# EAGLE schematic brains (EAGLE 5.11)

## Sheet 1 of 6
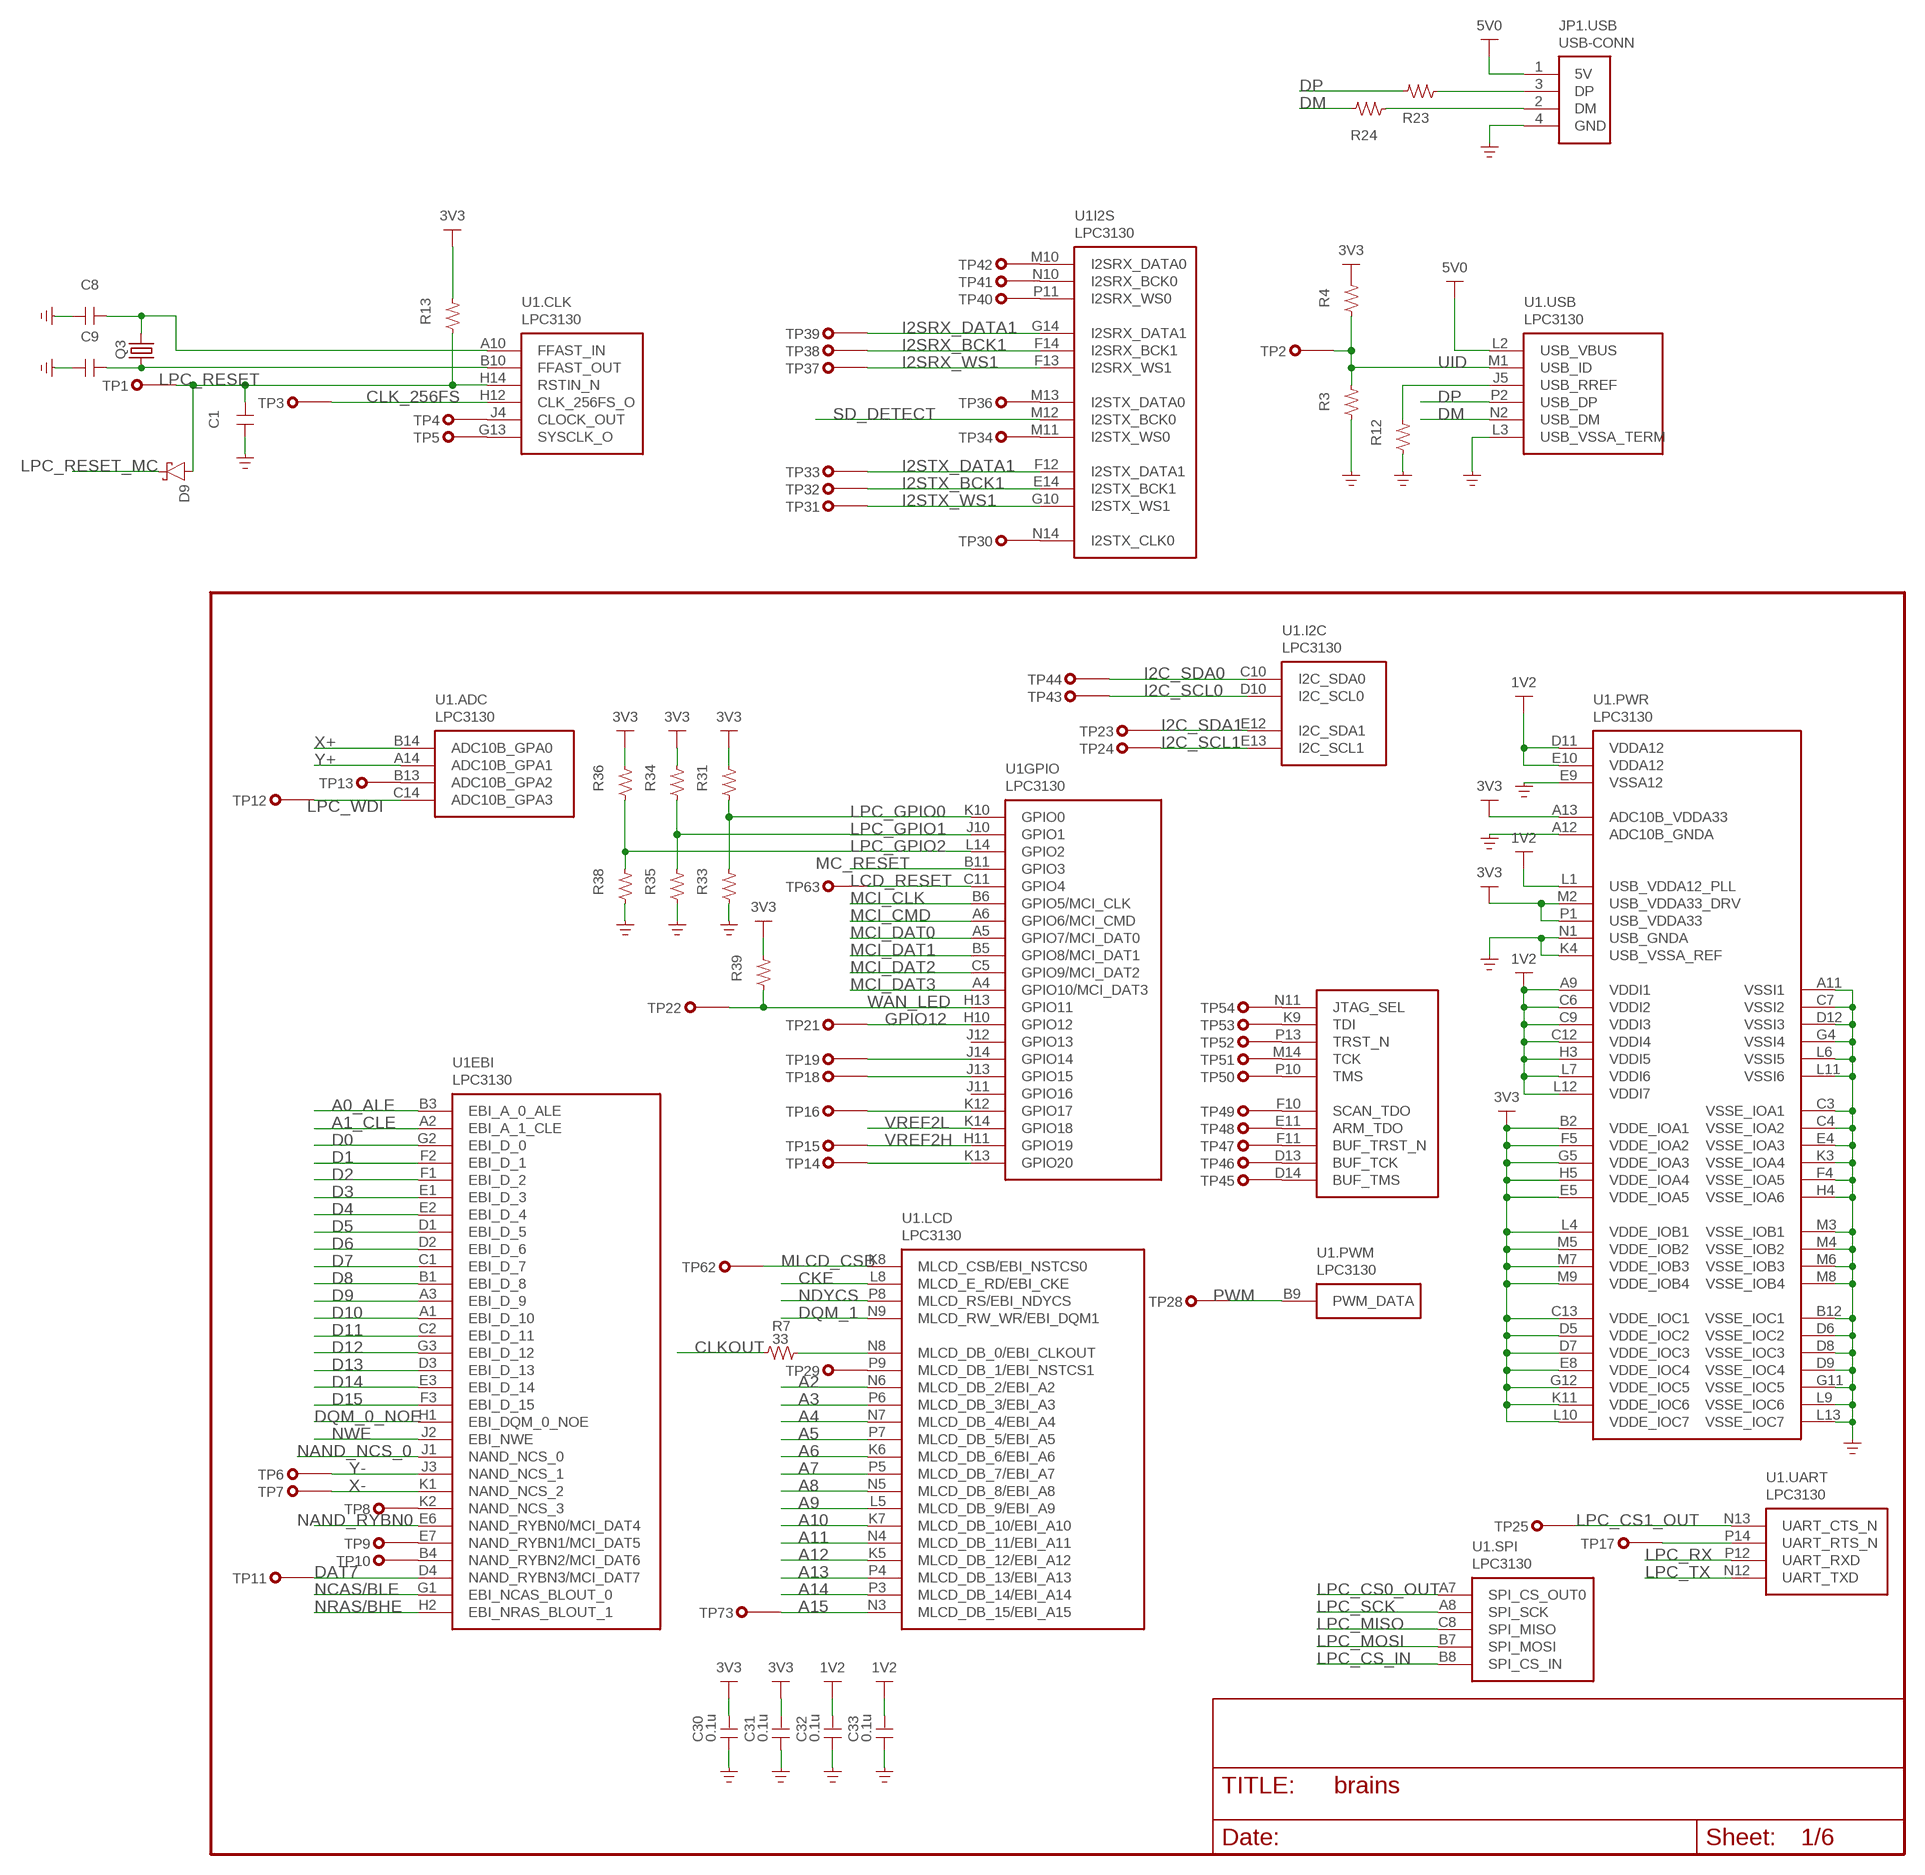
[diagram p0: schematic, sheet 1]

### Parts
C1  C-0805  [SMD0805]
C8  C-0603  [SMD0603]
C9  C-0603  [SMD0603]
C30  0.1u  C-0603  [SMD0603]
C31  0.1u  C-0603  [SMD0603]
C32  0.1u  C-0603  [SMD0603]
C33  0.1u  C-0603  [SMD0603]
D9  D-SCHOTTKY-0603  [0603-SCHOTTKY]
JP1  USB-CONN  [UE27AC]
Q3  CRYSTAL  [SM49]
R3  R-0603  [SMD0603]
R4  R-0603  [SMD0603]
R7  33  R-0603  [SMD0603]
R12  R-0603  [SMD0603]
R13  R-0603  [SMD0603]
R23  R-0603  [SMD0603]
R24  R-0603  [SMD0603]
R31  R-0603  [SMD0603]
R33  R-0603  [SMD0603]
R34  R-0603  [SMD0603]
R35  R-0603  [SMD0603]
R36  R-0603  [SMD0603]
R38  R-0603  [SMD0603]
R39  R-0603  [SMD0603]
TP1  TP-10MIL  [10MIL]
TP2  TP-10MIL  [10MIL]
TP3  TP-10MIL  [10MIL]
TP4  TP-10MIL  [10MIL]
TP5  TP-10MIL  [10MIL]
TP6  TP-10MIL  [10MIL]
TP7  TP-10MIL  [10MIL]
TP8  TP-10MIL  [10MIL]
TP9  TP-10MIL  [10MIL]
TP10  TP-10MIL  [10MIL]
TP11  TP-10MIL  [10MIL]
TP12  TP-10MIL  [10MIL]
TP13  TP-10MIL  [10MIL]
TP14  TP-10MIL  [10MIL]
TP15  TP-10MIL  [10MIL]
TP16  TP-10MIL  [10MIL]
TP17  TP-10MIL  [10MIL]
TP18  TP-10MIL  [10MIL]
TP19  TP-10MIL  [10MIL]
TP21  TP-10MIL  [10MIL]
TP22  TP-10MIL  [10MIL]
TP23  TP-10MIL  [10MIL]
TP24  TP-10MIL  [10MIL]
TP25  TP-10MIL  [10MIL]
TP28  TP-10MIL  [10MIL]
TP29  TP-10MIL  [10MIL]
TP30  TP-10MIL  [10MIL]
TP31  TP-10MIL  [10MIL]
TP32  TP-10MIL  [10MIL]
TP33  TP-10MIL  [10MIL]
TP34  TP-10MIL  [10MIL]
TP36  TP-10MIL  [10MIL]
TP37  TP-10MIL  [10MIL]
TP38  TP-10MIL  [10MIL]
TP39  TP-10MIL  [10MIL]
TP40  TP-10MIL  [10MIL]
TP41  TP-10MIL  [10MIL]
TP42  TP-10MIL  [10MIL]
TP43  TP-10MIL  [10MIL]
TP44  TP-10MIL  [10MIL]
TP45  TP-10MIL  [10MIL]
TP46  TP-10MIL  [10MIL]
TP47  TP-10MIL  [10MIL]
TP48  TP-10MIL  [10MIL]
TP49  TP-10MIL  [10MIL]
TP50  TP-10MIL  [10MIL]
TP51  TP-10MIL  [10MIL]
TP52  TP-10MIL  [10MIL]
TP53  TP-10MIL  [10MIL]
TP54  TP-10MIL  [10MIL]
TP62  TP-10MIL  [10MIL]
TP63  TP-10MIL  [10MIL]
TP73  TP-10MIL  [10MIL]
U1  LPC3130  [SOT570-3]

### Nets
1V2: C32.2 C33.2 U1.A9(.PWR:VDDI1) U1.C6(.PWR:VDDI2) U1.C9(.PWR:VDDI3) U1.C12(.PWR:VDDI4) U1.D11(.PWR:VDDA12) U1.E10(.PWR:VDDA12) U1.H3(.PWR:VDDI5) U1.L1(.PWR:USB_VDDA12_PLL) U1.L7(.PWR:VDDI6) U1.L12(.PWR:VDDI7) ; also sheet 5
3V3 [power]: C30.2 C31.2 R4.2 R13.2 R31.2 R34.2 R36.2 R39.2 U1.A13(.PWR:ADC10B_VDDA33) U1.B2(.PWR:VDDE_IOA1) U1.C13(.PWR:VDDE_IOC1) U1.D5(.PWR:VDDE_IOC2) U1.D7(.PWR:VDDE_IOC3) U1.E5(.PWR:VDDE_IOA5) U1.E8(.PWR:VDDE_IOC4) U1.F5(.PWR:VDDE_IOA2) U1.G5(.PWR:VDDE_IOA3) U1.G12(.PWR:VDDE_IOC5) U1.H5(.PWR:VDDE_IOA4) U1.K11(.PWR:VDDE_IOC6) U1.L4(.PWR:VDDE_IOB1) U1.L10(.PWR:VDDE_IOC7) U1.M2(.PWR:USB_VDDA33_DRV) U1.M5(.PWR:VDDE_IOB2) U1.M7(.PWR:VDDE_IOB3) U1.M9(.PWR:VDDE_IOB4) U1.P1(.PWR:USB_VDDA33) ; also sheet 2,3,4,5,6
5V0: JP1.1(.USB:5V) U1.L2(.USB:USB_VBUS) ; also sheet 3,5
A0_ALE: U1.B3(EBI:EBI_A_0_ALE) ; also sheet 2
A1_CLE: U1.A2(EBI:EBI_A_1_CLE) ; also sheet 2
A2: U1.N6(.LCD:MLCD_DB_2/EBI_A2) ; also sheet 2
A3: U1.P6(.LCD:MLCD_DB_3/EBI_A3) ; also sheet 2
A4: U1.N7(.LCD:MLCD_DB_4/EBI_A4) ; also sheet 2
A5: U1.P7(.LCD:MLCD_DB_5/EBI_A5) ; also sheet 2
A6: U1.K6(.LCD:MLCD_DB_6/EBI_A6) ; also sheet 2
A7: U1.P5(.LCD:MLCD_DB_7/EBI_A7) ; also sheet 2
A8: U1.N5(.LCD:MLCD_DB_8/EBI_A8) ; also sheet 2
A9: U1.L5(.LCD:MLCD_DB_9/EBI_A9) ; also sheet 2
A10: U1.K7(.LCD:MLCD_DB_10/EBI_A10) ; also sheet 2
A11: U1.N4(.LCD:MLCD_DB_11/EBI_A11) ; also sheet 2
A12: U1.K5(.LCD:MLCD_DB_12/EBI_A12) ; also sheet 2
A13: U1.P4(.LCD:MLCD_DB_13/EBI_A13) ; also sheet 2
A14: U1.P3(.LCD:MLCD_DB_14/EBI_A14) ; also sheet 2
A15: TP73.1 U1.N3(.LCD:MLCD_DB_15/EBI_A15)
CKE: U1.L8(.LCD:MLCD_E_RD/EBI_CKE) ; also sheet 2
CLK_256FS: TP3.1 U1.H12(.CLK:CLK_256FS_O)
CLKOUT: R7.1 ; also sheet 2
D0: U1.G2(EBI:EBI_D_0) ; also sheet 2
D1: U1.F2(EBI:EBI_D_1) ; also sheet 2
D2: U1.F1(EBI:EBI_D_2) ; also sheet 2
D3: U1.E1(EBI:EBI_D_3) ; also sheet 2
D4: U1.E2(EBI:EBI_D_4) ; also sheet 2
D5: U1.D1(EBI:EBI_D_5) ; also sheet 2
D6: U1.D2(EBI:EBI_D_6) ; also sheet 2
D7: U1.C1(EBI:EBI_D_7) ; also sheet 2
D8: U1.B1(EBI:EBI_D_8) ; also sheet 2
D9: U1.A3(EBI:EBI_D_9) ; also sheet 2
D10: U1.A1(EBI:EBI_D_10) ; also sheet 2
D11: U1.C2(EBI:EBI_D_11) ; also sheet 2
D12: U1.G3(EBI:EBI_D_12) ; also sheet 2
D13: U1.D3(EBI:EBI_D_13) ; also sheet 2
D14: U1.E3(EBI:EBI_D_14) ; also sheet 2
D15: U1.F3(EBI:EBI_D_15) ; also sheet 2
DAT7: TP11.1 U1.D4(EBI:NAND_RYBN3/MCI_DAT7)
DM: R24.2 U1.N2(.USB:USB_DM)
DP: R23.2 U1.P2(.USB:USB_DP)
DQM_0_NOE: U1.H1(EBI:EBI_DQM_0_NOE) ; also sheet 2
DQM_1: U1.N9(.LCD:MLCD_RW_WR/EBI_DQM1) ; also sheet 2
GND [power]: C1.1 C8.1 C9.1 C30.1 C31.1 C32.1 C33.1 JP1.4(.USB:GND) R3.1 R12.1 R33.1 R35.1 R38.1 U1.A11(.PWR:VSSI1) U1.A12(.PWR:ADC10B_GNDA) U1.B12(.PWR:VSSE_IOC1) U1.C3(.PWR:VSSE_IOA1) U1.C4(.PWR:VSSE_IOA2) U1.C7(.PWR:VSSI2) U1.D6(.PWR:VSSE_IOC2) U1.D8(.PWR:VSSE_IOC3) U1.D9(.PWR:VSSE_IOC4) U1.D12(.PWR:VSSI3) U1.E4(.PWR:VSSE_IOA3) U1.E9(.PWR:VSSA12) U1.F4(.PWR:VSSE_IOA5) U1.G4(.PWR:VSSI4) U1.G11(.PWR:VSSE_IOC5) U1.H4(.PWR:VSSE_IOA6) U1.K3(.PWR:VSSE_IOA4) U1.K4(.PWR:USB_VSSA_REF) U1.L3(.USB:USB_VSSA_TERM) U1.L6(.PWR:VSSI5) U1.L9(.PWR:VSSE_IOC6) U1.L11(.PWR:VSSI6) U1.L13(.PWR:VSSE_IOC7) U1.M3(.PWR:VSSE_IOB1) U1.M4(.PWR:VSSE_IOB2) U1.M6(.PWR:VSSE_IOB3) U1.M8(.PWR:VSSE_IOB4) U1.N1(.PWR:USB_GNDA) ; also sheet 2,3,4,5,6
GPIO12: TP21.1 U1.H10(GPIO:GPIO12) ; also sheet 3
I2C_SCL0: TP43.1 U1.D10(.I2C:I2C_SCL0) ; also sheet 3
I2C_SCL1: TP24.1 U1.E13(.I2C:I2C_SCL1)
I2C_SDA0: TP44.1 U1.C10(.I2C:I2C_SDA0) ; also sheet 3
I2C_SDA1: TP23.1 U1.E12(.I2C:I2C_SDA1)
I2SRX_BCK1: TP38.1 U1.F14(I2S:I2SRX_BCK1)
I2SRX_DATA1: TP39.1 U1.G14(I2S:I2SRX_DATA1)
I2SRX_WS1: TP37.1 U1.F13(I2S:I2SRX_WS1)
I2STX_BCK1: TP32.1 U1.E14(I2S:I2STX_BCK1)
I2STX_DATA1: TP33.1 U1.F12(I2S:I2STX_DATA1)
I2STX_WS1: TP31.1 U1.G10(I2S:I2STX_WS1)
LCD_RESET: TP63.1 U1.C11(GPIO:GPIO4)
LPC_CS0_OUT: U1.A7(.SPI:SPI_CS_OUT0) ; also sheet 3
LPC_CS1_OUT: TP25.1 U1.N13(.UART:UART_CTS_N)
LPC_CS_IN: U1.B8(.SPI:SPI_CS_IN)
LPC_GPIO0: R31.1 R33.2 U1.K10(GPIO:GPIO0) ; also sheet 6
LPC_GPIO1: R34.1 R35.2 U1.J10(GPIO:GPIO1) ; also sheet 6
LPC_GPIO2: R36.1 R38.2 U1.L14(GPIO:GPIO2) ; also sheet 6
LPC_MISO: U1.C8(.SPI:SPI_MISO) ; also sheet 3
LPC_MOSI: U1.B7(.SPI:SPI_MOSI) ; also sheet 3
LPC_RESET: C1.2 D9.A R13.1 TP1.1 U1.H14(.CLK:RSTIN_N) ; also sheet 6
LPC_RESET_MC: D9.K(C)
LPC_RX: U1.P12(.UART:UART_RXD) ; also sheet 6
LPC_SCK: U1.A8(.SPI:SPI_SCK) ; also sheet 3
LPC_TX: U1.N12(.UART:UART_TXD) ; also sheet 6
LPC_WDI: TP12.1 U1.C14(.ADC:ADC10B_GPA3)
MC_RESET: U1.B11(GPIO:GPIO3) ; also sheet 4
MCI_CLK: U1.B6(GPIO:GPIO5/MCI_CLK) ; also sheet 2
MCI_CMD: U1.A6(GPIO:GPIO6/MCI_CMD) ; also sheet 2
MCI_DAT0: U1.A5(GPIO:GPIO7/MCI_DAT0) ; also sheet 2
MCI_DAT1: U1.B5(GPIO:GPIO8/MCI_DAT1) ; also sheet 2
MCI_DAT2: U1.C5(GPIO:GPIO9/MCI_DAT2) ; also sheet 2
MCI_DAT3: U1.A4(GPIO:GPIO10/MCI_DAT3) ; also sheet 2
MLCD_CSB: TP62.1 U1.K8(.LCD:MLCD_CSB/EBI_NSTCS0)
N$1: R7.2 U1.N8(.LCD:MLCD_DB_0/EBI_CLKOUT)
N$6: R12.2 U1.J5(.USB:USB_RREF)
N$8: C9.2 Q3.1 U1.B10(.CLK:FFAST_OUT)
N$9: C8.2 Q3.2 U1.A10(.CLK:FFAST_IN)
N$15: TP4.1 U1.J4(.CLK:CLOCK_OUT)
N$16: TP5.1 U1.G13(.CLK:SYSCLK_O)
N$19 [usb]: JP1.3(.USB:DP) R23.1
N$20 [usb]: JP1.2(.USB:DM) R24.1
N$24: TP17.1 U1.P14(.UART:UART_RTS_N)
N$41: TP8.1 U1.K2(EBI:NAND_NCS_3)
N$43: TP9.1 U1.E7(EBI:NAND_RYBN1/MCI_DAT5)
N$44: TP10.1 U1.B4(EBI:NAND_RYBN2/MCI_DAT6)
N$48: TP13.1 U1.B13(.ADC:ADC10B_GPA2)
N$49: TP14.1 U1.K13(GPIO:GPIO20)
N$51: TP16.1 U1.K12(GPIO:GPIO17)
N$53: TP18.1 U1.J13(GPIO:GPIO15)
N$54: TP19.1 U1.J14(GPIO:GPIO14)
N$64: TP29.1 U1.P9(.LCD:MLCD_DB_1/EBI_NSTCS1)
N$65: TP30.1 U1.N14(I2S:I2STX_CLK0)
N$69: TP34.1 U1.M11(I2S:I2STX_WS0)
N$71: TP36.1 U1.M13(I2S:I2STX_DATA0)
N$75: TP40.1 U1.P11(I2S:I2SRX_WS0)
N$76: TP41.1 U1.N10(I2S:I2SRX_BCK0)
N$77: TP42.1 U1.M10(I2S:I2SRX_DATA0)
N$80: TP45.1 U1.D14(.JTAG:BUF_TMS)
N$81: TP46.1 U1.D13(.JTAG:BUF_TCK)
N$82: TP48.1 U1.E11(.JTAG:ARM_TDO)
N$83: TP49.1 U1.F10(.JTAG:SCAN_TDO)
N$84: TP50.1 U1.P10(.JTAG:TMS)
N$85: TP51.1 U1.M14(.JTAG:TCK)
N$86: TP52.1 U1.P13(.JTAG:TRST_N)
N$87: TP53.1 U1.K9(.JTAG:TDI)
N$88: TP54.1 U1.N11(.JTAG:JTAG_SEL)
N$89: TP47.1 U1.F11(.JTAG:BUF_TRST_N)
NAND_NCS_0: U1.J1(EBI:NAND_NCS_0)
NAND_RYBN0: U1.E6(EBI:NAND_RYBN0/MCI_DAT4)
NCAS/BLE: U1.G1(EBI:EBI_NCAS_BLOUT_0) ; also sheet 2
NDYCS: U1.P8(.LCD:MLCD_RS/EBI_NDYCS) ; also sheet 2
NRAS/BHE: U1.H2(EBI:EBI_NRAS_BLOUT_1) ; also sheet 2
NWE: U1.J2(EBI:EBI_NWE) ; also sheet 2
PWM: TP28.1 U1.B9(.PWM:PWM_DATA) ; also sheet 3
SD_DETECT: U1.M12(I2S:I2STX_BCK0) ; also sheet 2
UID [power]: R3.2 R4.1 TP2.1 U1.M1(.USB:USB_ID)
VREF2H: TP15.1 U1.H11(GPIO:GPIO19) ; also sheet 4
VREF2L: U1.K14(GPIO:GPIO18) ; also sheet 4
WAN_LED: R39.1 TP22.1 U1.H13(GPIO:GPIO11) ; also sheet 6
X+: U1.B14(.ADC:ADC10B_GPA0)
X-: TP7.1 U1.K1(EBI:NAND_NCS_2)
Y+: U1.A14(.ADC:ADC10B_GPA1)
Y-: TP6.1 U1.J3(EBI:NAND_NCS_1)
Unconnected: JP1.S1(SHLD) JP1.S2(SHLD) U1.J11(GPIO:GPIO16) U1.J12(GPIO:GPIO13)

## Sheet 2 of 6
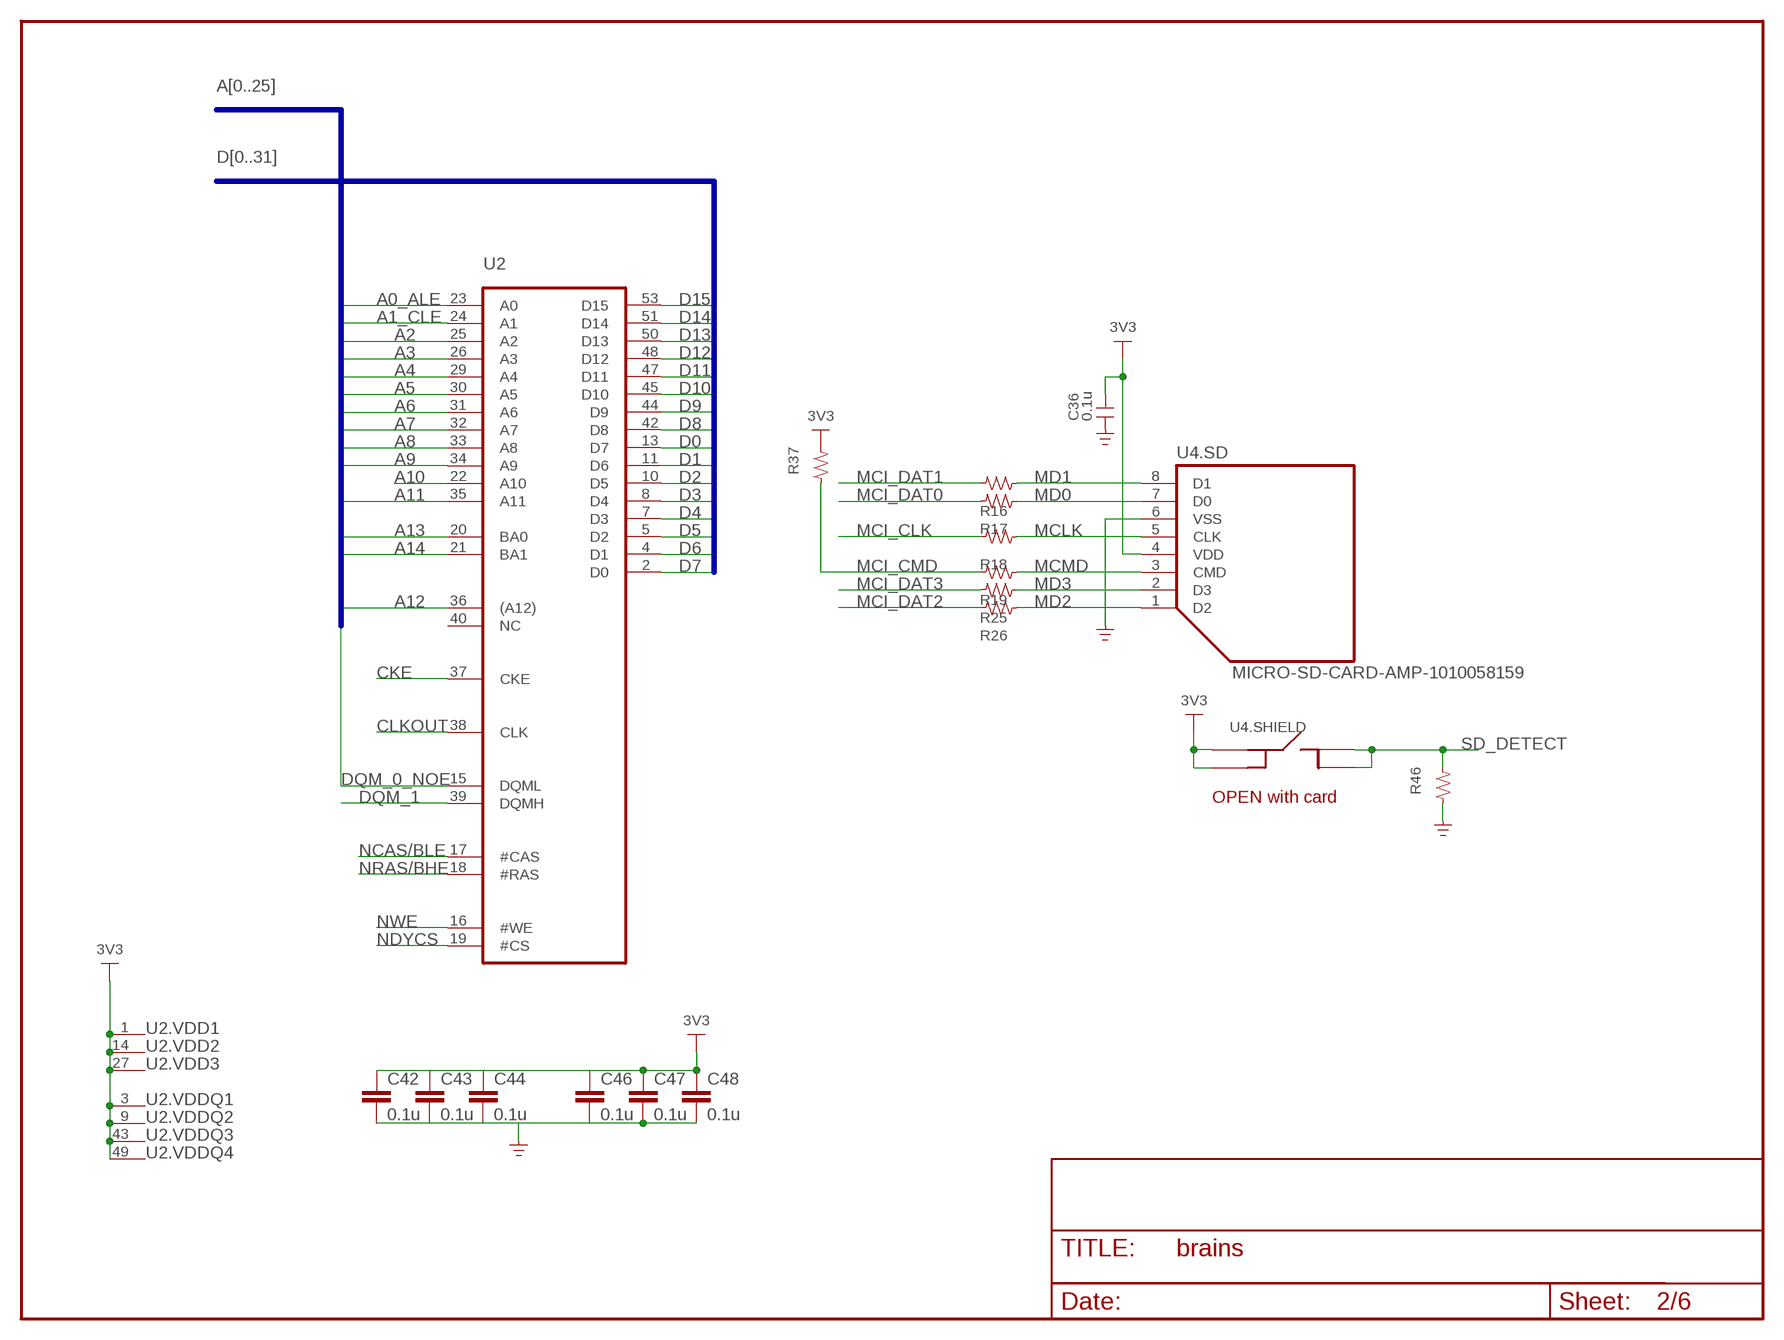
[diagram p1: schematic, sheet 2]

### Parts
C36  0.1u  C-0603  [SMD0603]
C42  0.1u  C-NOPOL-0603  [C0603]
C43  0.1u  C-NOPOL-0603  [C0603]
C44  0.1u  C-NOPOL-0603  [C0603]
C46  0.1u  C-NOPOL-0603  [C0603]
C47  0.1u  C-NOPOL-0603  [C0603]
C48  0.1u  C-NOPOL-0603  [C0603]
R16  R-0603  [SMD0603]
R17  R-0603  [SMD0603]
R18  R-0603  [SMD0603]
R19  R-0603  [SMD0603]
R25  R-0603  [SMD0603]
R26  R-0603  [SMD0603]
R37  R-0603  [SMD0603]
R46  R-0603  [SMD0603]
U2  MT48LC8M16A2  [TSSOP-54]
U4  MICRO-SD-CARD-AMP-1010058159  [SD-MICRO-101-00581-59]

### Nets
3V3 [power]: C36.2 C42.1 C43.1 C44.1 C46.1 C47.1 C48.1 R37.2 U2.1(VDD) U2.3(VDDQ) U2.9(VDDQ) U2.14(VDD) U2.27(VDD) U2.43(VDDQ) U2.49(VDDQ) U4.4(.SD:VDD) U4.10-1(.SHIELD:SA1) U4.10-2(.SHIELD:SA2) ; also sheet 1,3,4,5,6
A0_ALE: U2.23(A0) ; also sheet 1
A1_CLE: U2.24(A1) ; also sheet 1
A2: U2.25(A2) ; also sheet 1
A3: U2.26(A3) ; also sheet 1
A4: U2.29(A4) ; also sheet 1
A5: U2.30(A5) ; also sheet 1
A6: U2.31(A6) ; also sheet 1
A7: U2.32(A7) ; also sheet 1
A8: U2.33(A8) ; also sheet 1
A9: U2.34(A9) ; also sheet 1
A10: U2.22(A10) ; also sheet 1
A11: U2.35(A11) ; also sheet 1
A12: U2.36((A12)) ; also sheet 1
A13: U2.20(BA0) ; also sheet 1
A14: U2.21(BA1) ; also sheet 1
CKE: U2.37(CKE) ; also sheet 1
CLKOUT: U2.38(CLK) ; also sheet 1
D0: U2.13(D7) ; also sheet 1
D1: U2.11(D6) ; also sheet 1
D2: U2.10(D5) ; also sheet 1
D3: U2.8(D4) ; also sheet 1
D4: U2.7(D3) ; also sheet 1
D5: U2.5(D2) ; also sheet 1
D6: U2.4(D1) ; also sheet 1
D7: U2.2(D0) ; also sheet 1
D8: U2.42(D8) ; also sheet 1
D9: U2.44(D9) ; also sheet 1
D10: U2.45(D10) ; also sheet 1
D11: U2.47(D11) ; also sheet 1
D12: U2.48(D12) ; also sheet 1
D13: U2.50(D13) ; also sheet 1
D14: U2.51(D14) ; also sheet 1
D15: U2.53(D15) ; also sheet 1
DQM_0_NOE: U2.15(DQML) ; also sheet 1
DQM_1: U2.39(DQMH) ; also sheet 1
GND [power]: C36.1 C42.2 C43.2 C44.2 C46.2 C47.2 C48.2 R46.1 U4.6(.SD:VSS) ; also sheet 1,3,4,5,6
MCI_CLK: R18.2 ; also sheet 1
MCI_CMD: R19.2 R37.1 ; also sheet 1
MCI_DAT0: R17.2 ; also sheet 1
MCI_DAT1: R16.2 ; also sheet 1
MCI_DAT2: R26.2 ; also sheet 1
MCI_DAT3: R25.2 ; also sheet 1
MCLK: R18.1 U4.5(.SD:CLK)
MCMD: R19.1 U4.3(.SD:CMD)
MD0: R17.1 U4.7(.SD:D0)
MD1: R16.1 U4.8(.SD:D1)
MD2: R26.1 U4.1(.SD:D2)
MD3: R25.1 U4.2(.SD:D3)
NCAS/BLE: U2.17(#CAS) ; also sheet 1
NDYCS: U2.19(#CS) ; also sheet 1
NRAS/BHE: U2.18(#RAS) ; also sheet 1
NWE: U2.16(#WE) ; also sheet 1
SD_DETECT: R46.2 U4.S1(.SHIELD:SB1) U4.S2(.SHIELD:SB2) ; also sheet 1
Unconnected: U2.40(NC)

### Buses
D[0..31]
A[0..25]

### Notes on the sheet
- OPEN with card

## Sheet 3 of 6
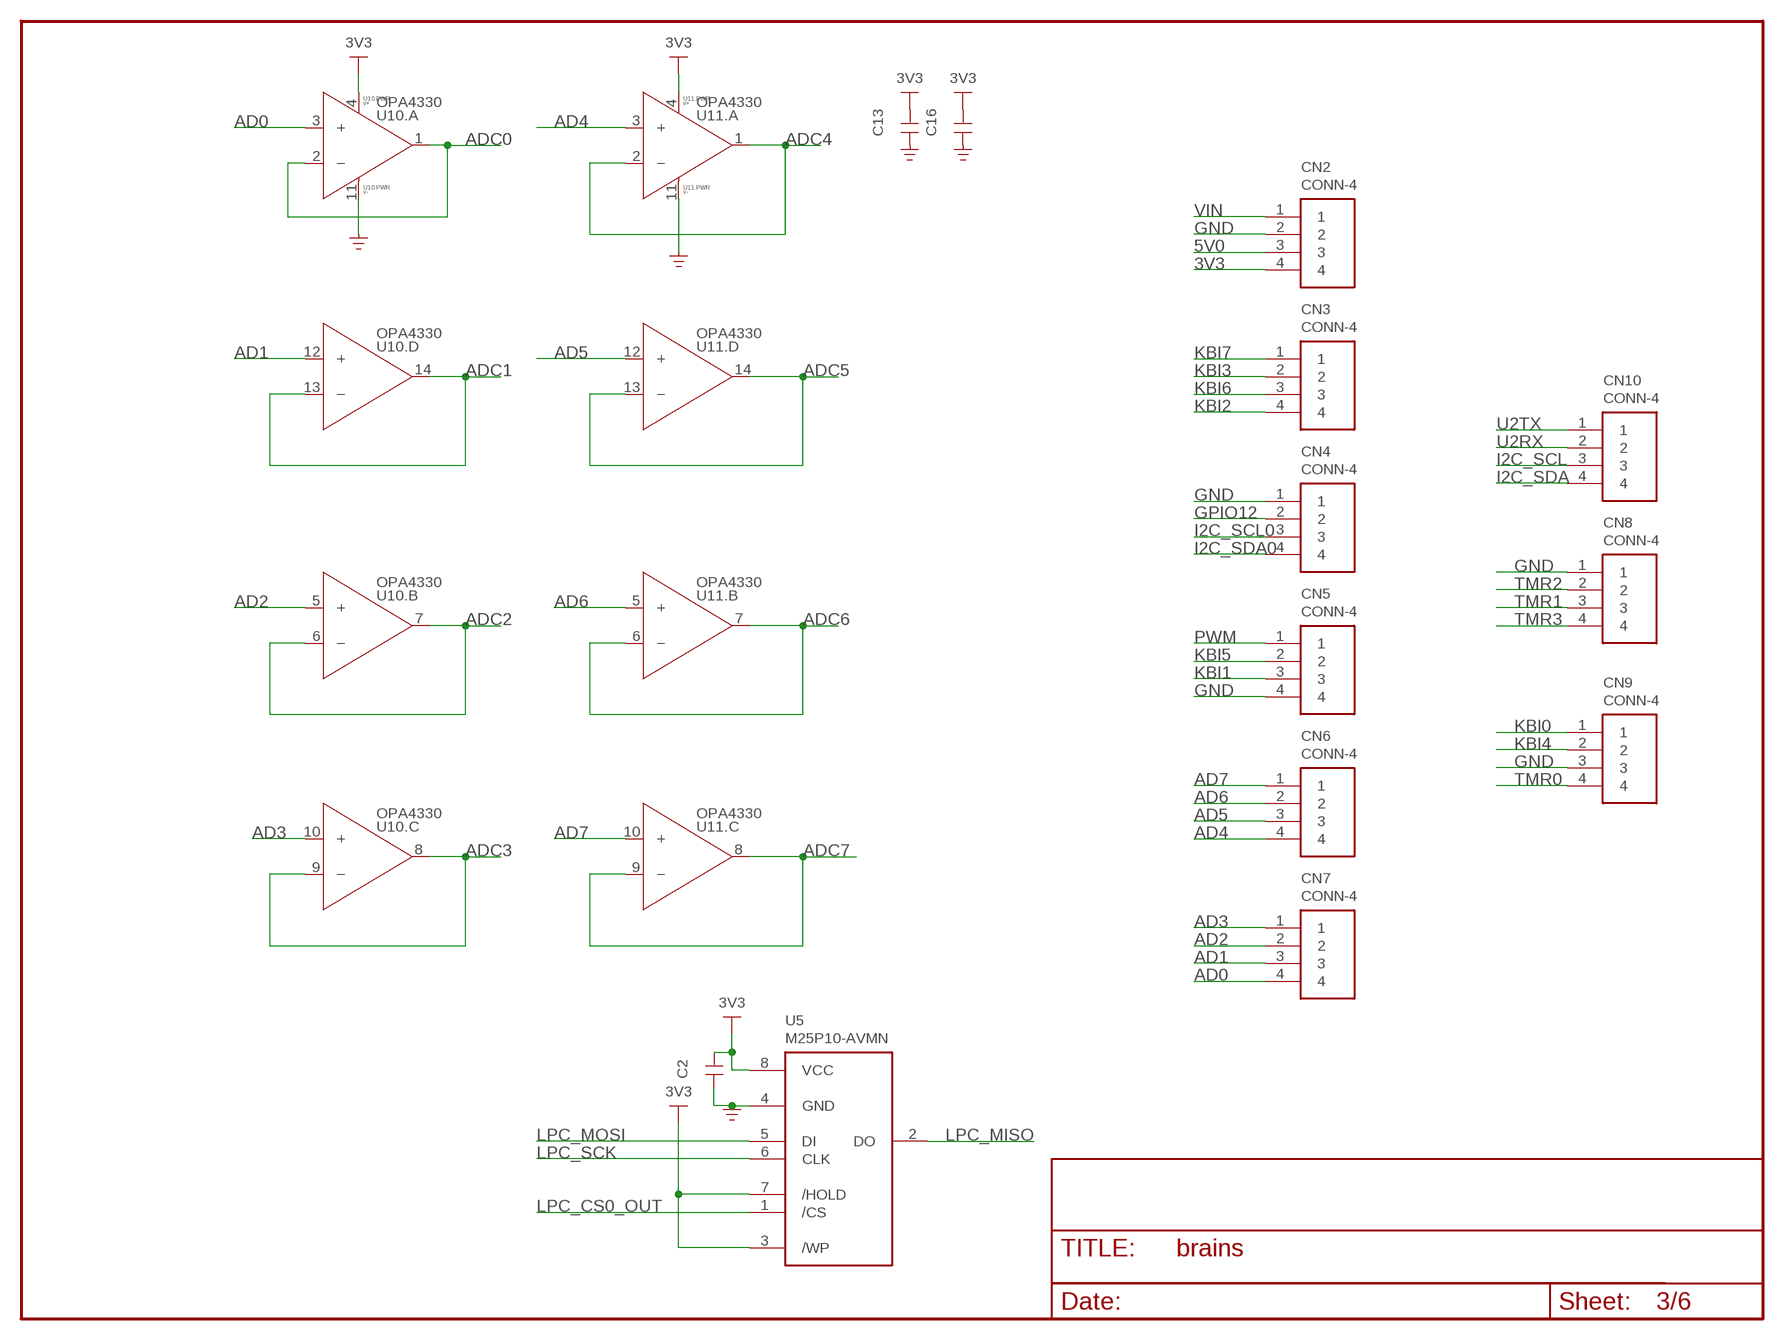
[diagram p2: schematic, sheet 3]

### Parts
C2  C-0603  [SMD0603]
C13  C-0603  [SMD0603]
C16  C-0603  [SMD0603]
CN2  CONN-4  [1X4-3.5MM]
CN3  CONN-4  [1X4-3.5MM]
CN4  CONN-4  [1X4-3.5MM]
CN5  CONN-4  [1X4-3.5MM]
CN6  CONN-4  [1X4-3.5MM]
CN7  CONN-4  [1X4-3.5MM]
CN8  CONN-4  [1X4-3.5MM]
CN9  CONN-4  [1X4-3.5MM]
CN10  CONN-4  [1X4-3.5MM]
U5  M25P10-AVMN  [M25-SO8]
U10  OPA4330  [SOIC-14]
U11  OPA4330  [SOIC-14]

### Nets
3V3 [power]: C2.2 C13.2 C16.2 CN2.4 U5.3(/WP) U5.7(/HOLD) U5.8(VCC) U10.4(.PWR:V+) U11.4(.PWR:V+) ; also sheet 1,2,4,5,6
5V0: CN2.3 ; also sheet 1,5
AD0: CN7.4 U10.3(.A:+)
AD1: CN7.3 U10.12(.D:+)
AD2: CN7.2 U10.5(.B:+)
AD3: CN7.1 U10.10(.C:+)
AD4: CN6.4 U11.3(.A:+)
AD5: CN6.3 U11.12(.D:+)
AD6: CN6.2 U11.5(.B:+)
AD7: CN6.1 U11.10(.C:+)
ADC0: U10.1(.A:OUT) U10.2(.A:-) ; also sheet 4
ADC1: U10.13(.D:-) U10.14(.D:OUT) ; also sheet 4
ADC2: U10.6(.B:-) U10.7(.B:OUT) ; also sheet 4
ADC3: U10.8(.C:OUT) U10.9(.C:-) ; also sheet 4
ADC4: U11.1(.A:OUT) U11.2(.A:-) ; also sheet 4
ADC5: U11.13(.D:-) U11.14(.D:OUT) ; also sheet 4
ADC6: U11.6(.B:-) U11.7(.B:OUT) ; also sheet 4
ADC7: U11.8(.C:OUT) U11.9(.C:-) ; also sheet 4
GND [power]: C2.1 C13.1 C16.1 CN2.2 CN4.1 CN5.4 CN8.1 CN9.3 U5.4(GND) U10.11(.PWR:V-) U11.11(.PWR:V-) ; also sheet 1,2,4,5,6
GPIO12: CN4.2 ; also sheet 1
I2C_SCL: CN10.3 ; also sheet 4
I2C_SCL0: CN4.3 ; also sheet 1
I2C_SDA: CN10.4 ; also sheet 4
I2C_SDA0: CN4.4 ; also sheet 1
KBI0: CN9.1 ; also sheet 4
KBI1: CN5.3 ; also sheet 4
KBI2: CN3.4 ; also sheet 4
KBI3: CN3.2 ; also sheet 4
KBI4: CN9.2 ; also sheet 4
KBI5: CN5.2 ; also sheet 4
KBI6: CN3.3 ; also sheet 4
KBI7: CN3.1 ; also sheet 4
LPC_CS0_OUT: U5.1(/CS) ; also sheet 1
LPC_MISO: U5.2(DO) ; also sheet 1
LPC_MOSI: U5.5(DI) ; also sheet 1
LPC_SCK: U5.6(CLK) ; also sheet 1
PWM: CN5.1 ; also sheet 1
TMR0: CN9.4 ; also sheet 4
TMR1: CN8.3 ; also sheet 4
TMR2: CN8.2 ; also sheet 4
TMR3: CN8.4 ; also sheet 4
U2RX: CN10.2 ; also sheet 4
U2TX: CN10.1 ; also sheet 4
VIN: CN2.1 ; also sheet 5

## Sheet 4 of 6
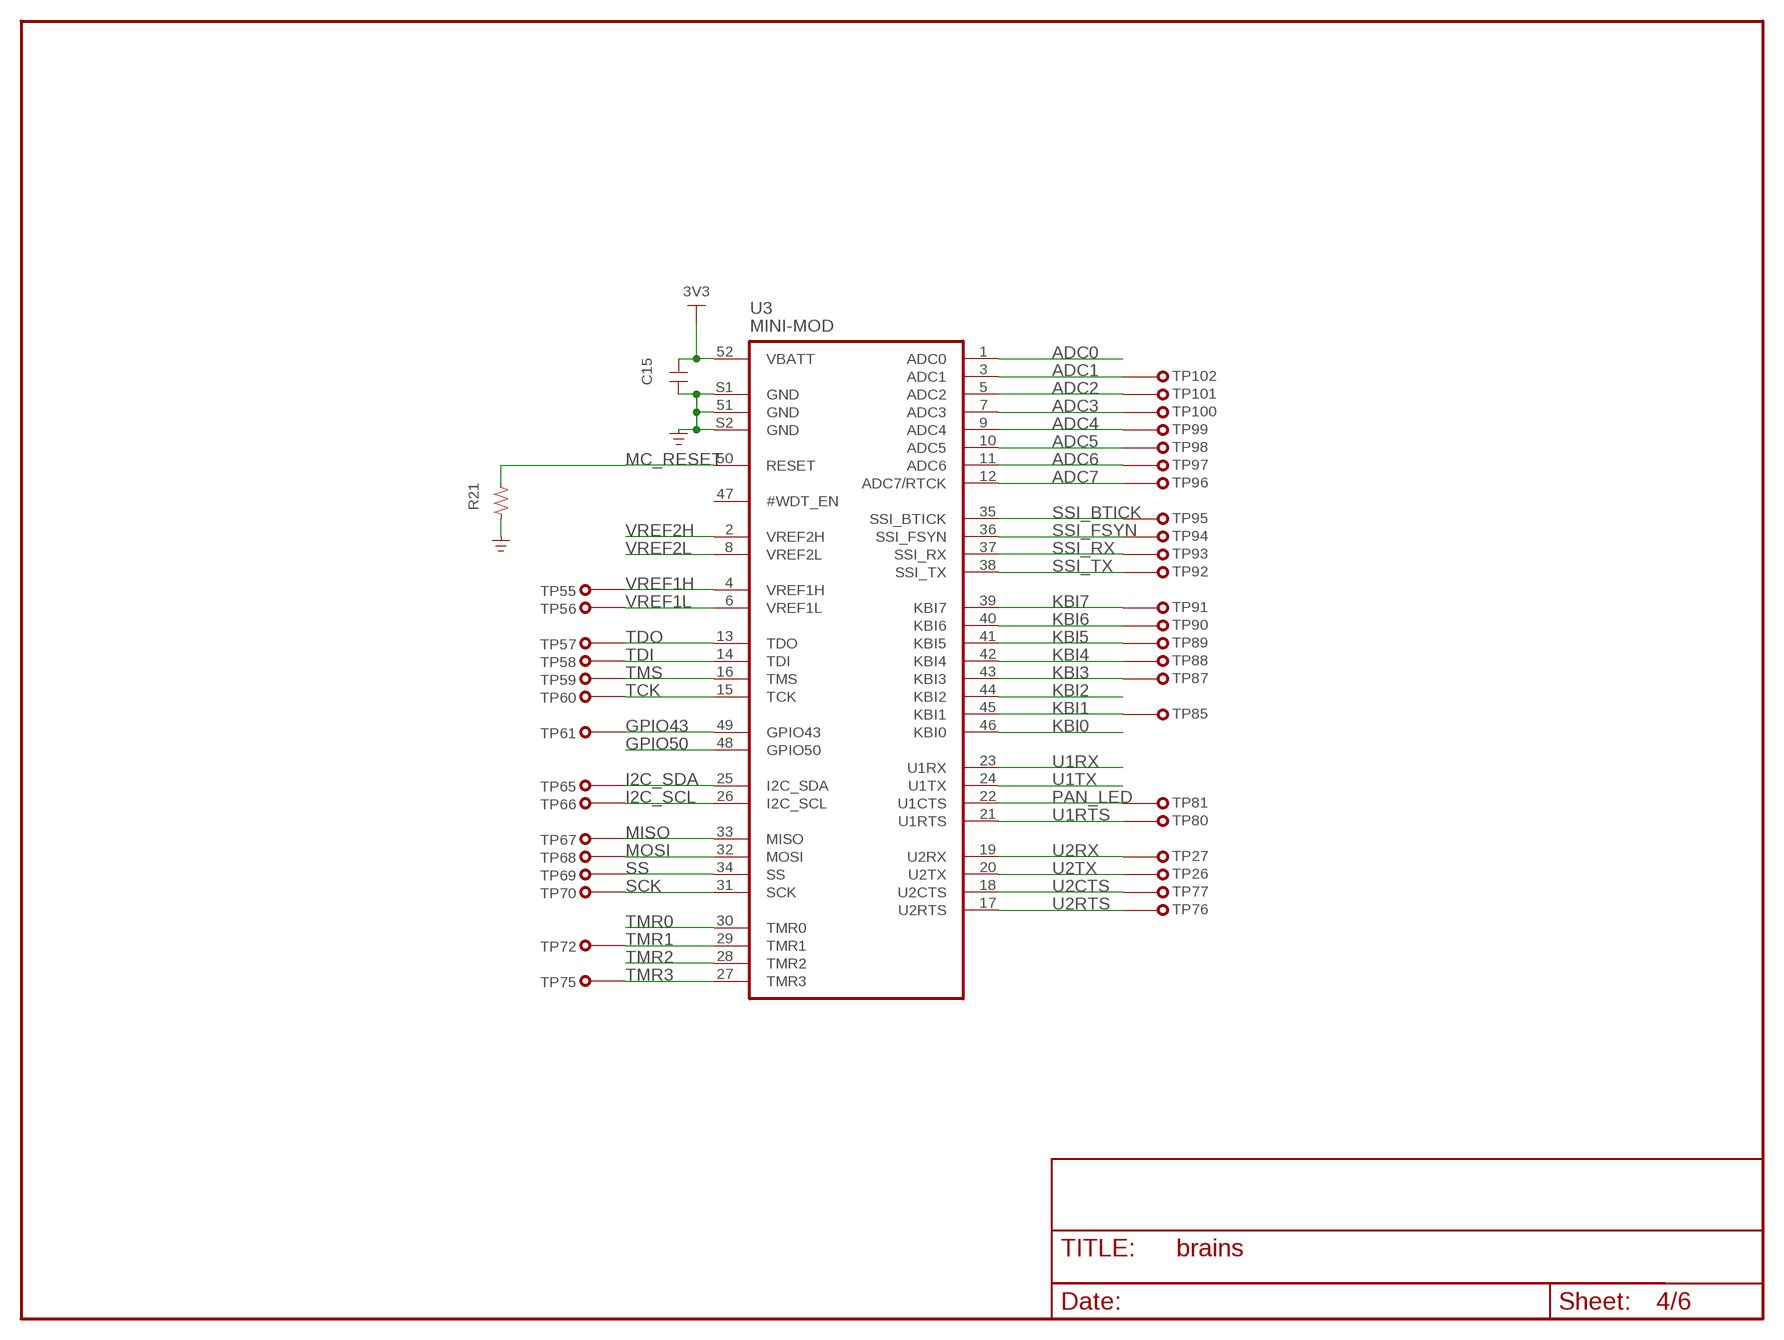
[diagram p3: schematic, sheet 4]

### Parts
C15  C-0603  [SMD0603]
R21  R-0603  [SMD0603]
TP26  TP  [15MIL]
TP27  TP  [15MIL]
TP55  TP  [15MIL]
TP56  TP  [15MIL]
TP57  TP  [15MIL]
TP58  TP  [15MIL]
TP59  TP  [15MIL]
TP60  TP  [15MIL]
TP61  TP  [15MIL]
TP65  TP  [15MIL]
TP66  TP  [15MIL]
TP67  TP  [15MIL]
TP68  TP  [15MIL]
TP69  TP  [15MIL]
TP70  TP  [15MIL]
TP72  TP  [15MIL]
TP75  TP  [15MIL]
TP76  TP  [15MIL]
TP77  TP  [15MIL]
TP80  TP  [15MIL]
TP81  TP  [15MIL]
TP85  TP  [15MIL]
TP87  TP  [15MIL]
TP88  TP  [15MIL]
TP89  TP  [15MIL]
TP90  TP  [15MIL]
TP91  TP  [15MIL]
TP92  TP  [15MIL]
TP93  TP  [15MIL]
TP94  TP  [15MIL]
TP95  TP  [15MIL]
TP96  TP  [15MIL]
TP97  TP  [15MIL]
TP98  TP  [15MIL]
TP99  TP  [15MIL]
TP100  TP  [15MIL]
TP101  TP  [15MIL]
TP102  TP  [15MIL]
U3  MINI-MOD  [MINI-MODULE]

### Nets
3V3 [power]: C15.2 U3.52(VBATT) ; also sheet 1,2,3,5,6
ADC0: U3.1(ADC0) ; also sheet 3
ADC1: TP102.1 U3.3(ADC1) ; also sheet 3
ADC2: TP101.1 U3.5(ADC2) ; also sheet 3
ADC3: TP100.1 U3.7(ADC3) ; also sheet 3
ADC4: TP99.1 U3.9(ADC4) ; also sheet 3
ADC5: TP98.1 U3.10(ADC5) ; also sheet 3
ADC6: TP97.1 U3.11(ADC6) ; also sheet 3
ADC7: TP96.1 U3.12(ADC7/RTCK) ; also sheet 3
GND [power]: C15.1 R21.1 U3.51(GND) U3.S1(GND) U3.S2(GND) ; also sheet 1,2,3,5,6
GPIO43: TP61.1 U3.49(GPIO43)
GPIO50: U3.48(GPIO50)
I2C_SCL: TP66.1 U3.26(I2C_SCL) ; also sheet 3
I2C_SDA: TP65.1 U3.25(I2C_SDA) ; also sheet 3
KBI0: U3.46(KBI0) ; also sheet 3
KBI1: TP85.1 U3.45(KBI1) ; also sheet 3
KBI2: U3.44(KBI2) ; also sheet 3
KBI3: TP87.1 U3.43(KBI3) ; also sheet 3
KBI4: TP88.1 U3.42(KBI4) ; also sheet 3
KBI5: TP89.1 U3.41(KBI5) ; also sheet 3
KBI6: TP90.1 U3.40(KBI6) ; also sheet 3
KBI7: TP91.1 U3.39(KBI7) ; also sheet 3
MC_RESET: R21.2 U3.50(RESET) ; also sheet 1
MISO: TP67.1 U3.33(MISO)
MOSI: TP68.1 U3.32(MOSI)
PAN_LED: TP81.1 U3.22(U1CTS) ; also sheet 6
SCK: TP70.1 U3.31(SCK)
SS: TP69.1 U3.34(SS)
SSI_BTICK: TP95.1 U3.35(SSI_BTICK)
SSI_FSYN: TP94.1 U3.36(SSI_FSYN)
SSI_RX: TP93.1 U3.37(SSI_RX)
SSI_TX: TP92.1 U3.38(SSI_TX)
TCK: TP60.1 U3.15(TCK)
TDI: TP58.1 U3.14(TDI)
TDO: TP57.1 U3.13(TDO)
TMR0: U3.30(TMR0) ; also sheet 3
TMR1: TP72.1 U3.29(TMR1) ; also sheet 3
TMR2: U3.28(TMR2) ; also sheet 3
TMR3: TP75.1 U3.27(TMR3) ; also sheet 3
TMS: TP59.1 U3.16(TMS)
U1RTS: TP80.1 U3.21(U1RTS)
U1RX: U3.23(U1RX) ; also sheet 6
U1TX: U3.24(U1TX) ; also sheet 6
U2CTS: TP77.1 U3.18(U2CTS)
U2RTS: TP76.1 U3.17(U2RTS)
U2RX: TP27.1 U3.19(U2RX) ; also sheet 3
U2TX: TP26.1 U3.20(U2TX) ; also sheet 3
VREF1H: TP55.1 U3.4(VREF1H)
VREF1L: TP56.1 U3.6(VREF1L)
VREF2H: U3.2(VREF2H) ; also sheet 1
VREF2L: U3.8(VREF2L) ; also sheet 1
Unconnected: U3.47(#WDT_EN)

## Sheet 5 of 6
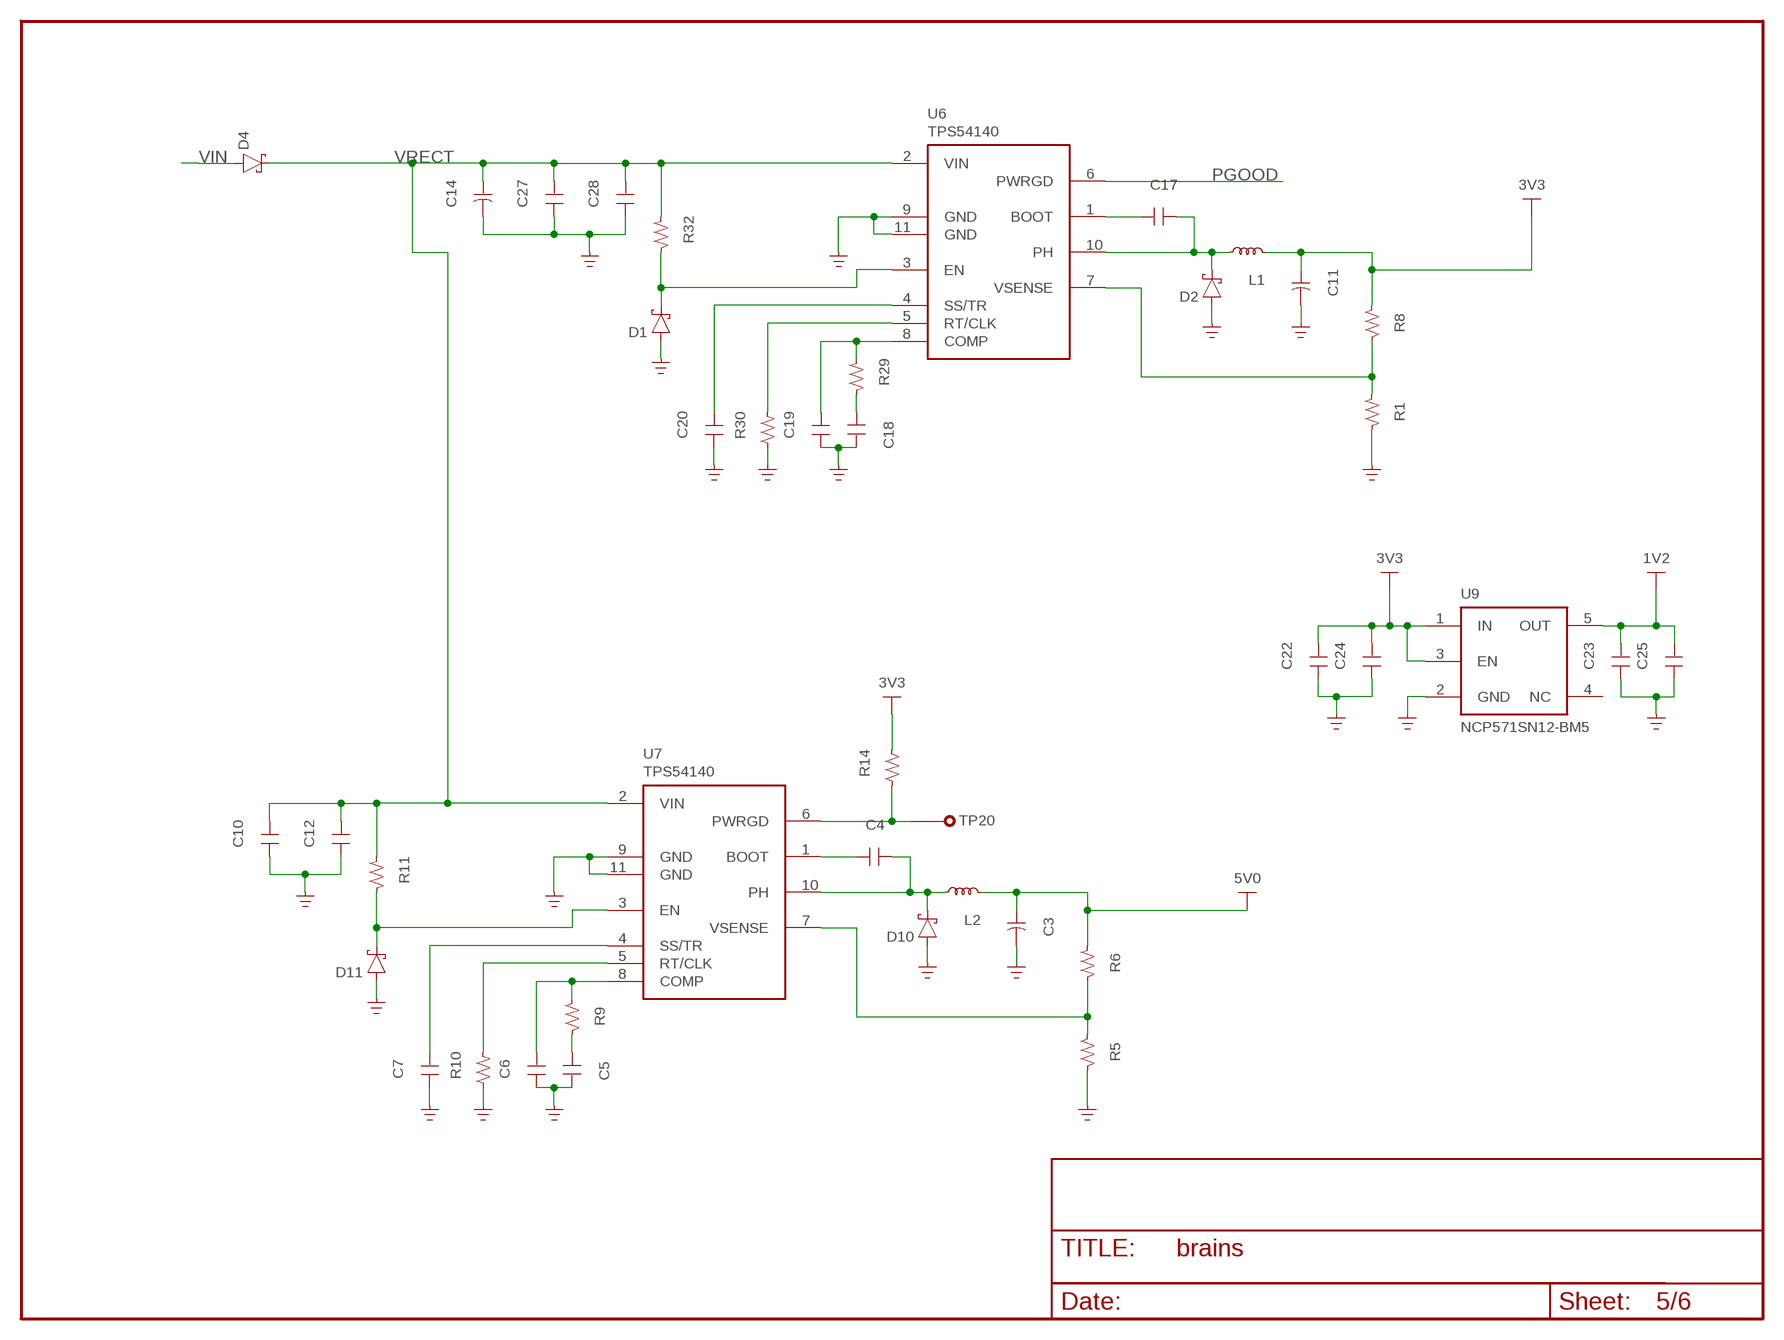
[diagram p4: schematic, sheet 5]

### Parts
C3  C-POL-6032  [CT6032]
C4  C-0603  [SMD0603]
C5  C-0603  [SMD0603]
C6  C-0603  [SMD0603]
C7  C-0603  [SMD0603]
C10  C-0805  [SMD0805]
C11  C-POL-6032  [CT6032]
C12  C-0603  [SMD0603]
C14  C-POL-D8  [PANASONIC-ELEC-D8]
C17  C-0603  [SMD0603]
C18  C-0603  [SMD0603]
C19  C-0603  [SMD0603]
C20  C-0603  [SMD0603]
C22  C-0805  [SMD0805]
C23  C-0805  [SMD0805]
C24  C-0603  [SMD0603]
C25  C-0603  [SMD0603]
C27  C-0805  [SMD0805]
C28  C-0603  [SMD0603]
D1  D-SCHOTTKY-0603  [0603-SCHOTTKY]
D2  D-SCHOTTKY-SMA  [DO-214-AC(SMA)]
D4  D-SCHOTTKY-SMA  [DO-214-AC(SMA)]
D10  D-SCHOTTKY-SMA  [DO-214-AC(SMA)]
D11  D-SCHOTTKY-0603  [0603-SCHOTTKY]
L1  L-NR60  [NR60]
L2  L-NR60  [NR60]
R1  R-0603  [SMD0603]
R5  R-0603  [SMD0603]
R6  R-0603  [SMD0603]
R8  R-0603  [SMD0603]
R9  R-0603  [SMD0603]
R10  R-0603  [SMD0603]
R11  R-0603  [SMD0603]
R14  R-0603  [SMD0603]
R29  R-0603  [SMD0603]
R30  R-0603  [SMD0603]
R32  R-0603  [SMD0603]
TP20  TP-10MIL  [10MIL]
U6  TPS54140  [POWERPAD-10]
U7  TPS54140  [POWERPAD-10]
U9  NCP571SN12-BM5  [SOT-23-5]

### Nets
1V2: C23.2 C25.2 U9.5(OUT) ; also sheet 1
3V3 [power]: C11.+ C22.2 C24.2 L1.2 R8.2 R14.2 U9.1(IN) U9.3(EN) ; also sheet 1,2,3,4,6
5V0: C3.+ L2.2 R6.2 ; also sheet 1,3
GND [power]: C3.- C5.2 C6.1 C7.1 C10.1 C11.- C12.1 C14.- C18.2 C19.1 C20.1 C22.1 C23.1 C24.1 C25.1 C27.1 C28.1 D1.A D2.A D10.A D11.A R1.1 R5.1 R10.1 R30.1 U6.9(GND) U6.11(GND) U7.9(GND) U7.11(GND) U9.2(GND) ; also sheet 1,2,3,4,6
N$3: C6.2 R9.2 U7.8(COMP)
N$5: C5.1 R9.1
N$7: R10.2 U7.5(RT/CLK)
N$10: C7.2 U7.4(SS/TR)
N$11: D11.K(C) R11.1 U7.3(EN)
N$12: C4.1 U7.1(BOOT)
N$13: C4.2 D10.C L2.1 U7.10(PH)
N$14: R5.2 R6.1 U7.7(VSENSE)
N$17: R14.1 TP20.1 U7.6(PWRGD)
N$30: C17.1 U6.1(BOOT)
N$36: C19.2 R29.2 U6.8(COMP)
N$37: C18.1 R29.1
N$38: R30.2 U6.5(RT/CLK)
N$39: C20.2 U6.4(SS/TR)
N$40: D1.K(C) R32.1 U6.3(EN)
N$42: C17.2 D2.C L1.1 U6.10(PH)
N$45: R1.2 R8.1 U6.7(VSENSE)
PGOOD: U6.6(PWRGD)
VIN: D4.A ; also sheet 3
VRECT: C10.2 C12.2 C14.+ C27.2 C28.2 D4.C R11.2 R32.2 U6.2(VIN) U7.2(VIN)
Unconnected: U9.4(NC)

## Sheet 6 of 6
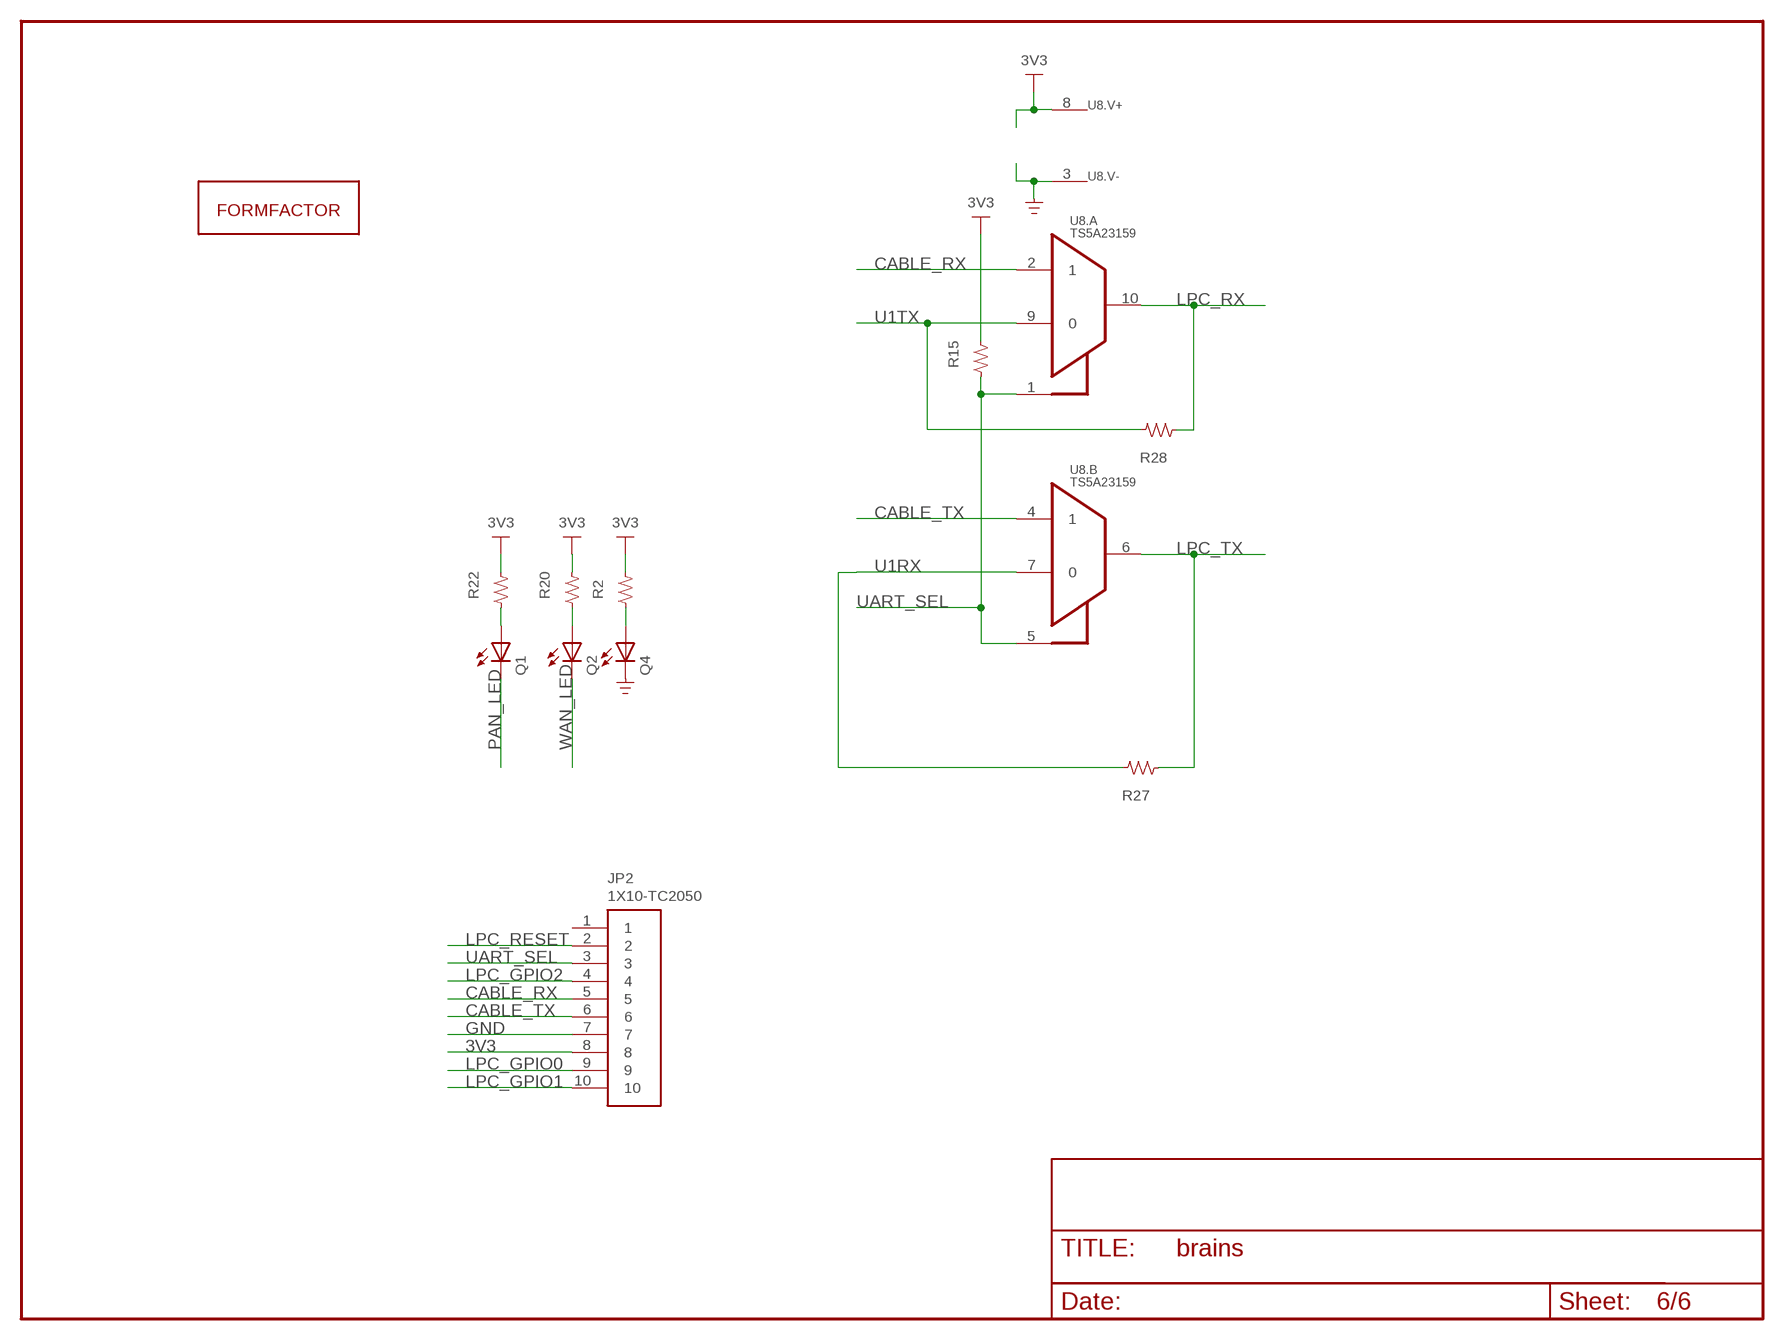
[diagram p5: schematic, sheet 6]

### Parts
FF1  FORMFACTOR  [FORMFACTOR]
JP2  1X10-TC2050  [TC2050-IDC]
Q1  LED-0603  [LED0603]
Q2  LED-0603  [LED0603]
Q4  LED-0603  [LED0603]
R2  R-0603  [SMD0603]
R15  R-0603  [SMD0603]
R20  R-0603  [SMD0603]
R22  R-0603  [SMD0603]
R27  R-0603  [SMD0603]
R28  R-0603  [SMD0603]
U8  TS5A23159  [MSOP-10]

### Nets
3V3 [power]: JP2.8 R2.2 R15.2 R20.2 R22.2 U8.8(.V+:V+) ; also sheet 1,2,3,4,5
CABLE_RX: JP2.5 U8.2
CABLE_TX: JP2.6 U8.4
GND [power]: JP2.7 Q4.C U8.3(.V-:V-) ; also sheet 1,2,3,4,5
LPC_GPIO0: JP2.9 ; also sheet 1
LPC_GPIO1: JP2.10 ; also sheet 1
LPC_GPIO2: JP2.4 ; also sheet 1
LPC_RESET: JP2.2 ; also sheet 1
LPC_RX: R28.1 U8.10(.A:C) ; also sheet 1
LPC_TX: R27.1 U8.6(.B:C) ; also sheet 1
N$2: Q4.A R2.1
N$4: Q1.A R22.1
N$18: Q2.A R20.1
PAN_LED: Q1.C ; also sheet 4
U1RX: R27.2 U8.7 ; also sheet 4
U1TX: R28.2 U8.9 ; also sheet 4
UART_SEL: JP2.3 R15.1 U8.1(.A:SEL) U8.5(.B:SEL)
WAN_LED: Q2.C ; also sheet 1
Unconnected: JP2.1

## Power pins joined to a net without a drawn wire
GND: U2.6(GND) U2.12(GND) U2.28(GND) U2.41(GND) U2.46(GND) U2.52(GND) U2.54(GND)

## Library data of the parts
C1 C2 C4-C10 C12 C13 C15-C20 C22-C25 C27 C28 C30-C33 C36 = parts:C
C3 C11 C14 = parts:C-POL
C42-C44 C46-C48 = parts:C-NOPOL
CN2-CN10 = parts:CONN-4
D1 D2 D4 D9-D11 = parts:D-SCHOTTKY
FF1 = parts:FORMFACTOR
JP1 = parts:USB-CONN
JP2 = parts:1X10
L1 L2 = parts:L: Bournes SSR1806 Series From mouser: SRR1806-151M, 150uH, 1.05A, $0.85 Coiltronics DR127 Series From mouser: DR127-470-R, 47uH, 5.28A, $1.87 DR127-680-R, 68uH, 4.44A, $1.87 J.W. Miller 2300 Series From mouser: 2313, 120uH, 6.7A, $2.78
Q1 Q2 Q4 = parts:LED
Q3 = parts:CRYSTAL: 12MHz 5032 Digikey = 535-9100-1-ND
R1-R39 R46 = parts:R
TP1-TP34 TP36-TP63 TP65-TP70 TP72 TP73 TP75-TP77 TP80 TP81 TP85 TP87-TP102 = parts:TP
U1 = parts:LPC313*
U2 = parts:MT48LC8M16A2
U3 = parts:MINI-MOD
U4 = parts:MICRO-SD-CARD
U5 = parts:M25P10-A
U6 U7 = parts:TPS54140
U8 = parts:TS5A23159
U9 = parts:NCP571SN*
U10 U11 = parts:OPA4330

## Net classes
2 rf: clearance 0.635 mm
3 usb: clearance 0.762 mm